# EasyEDA Pro project lune-v6-rev3.3.eprj, board PCB1_1
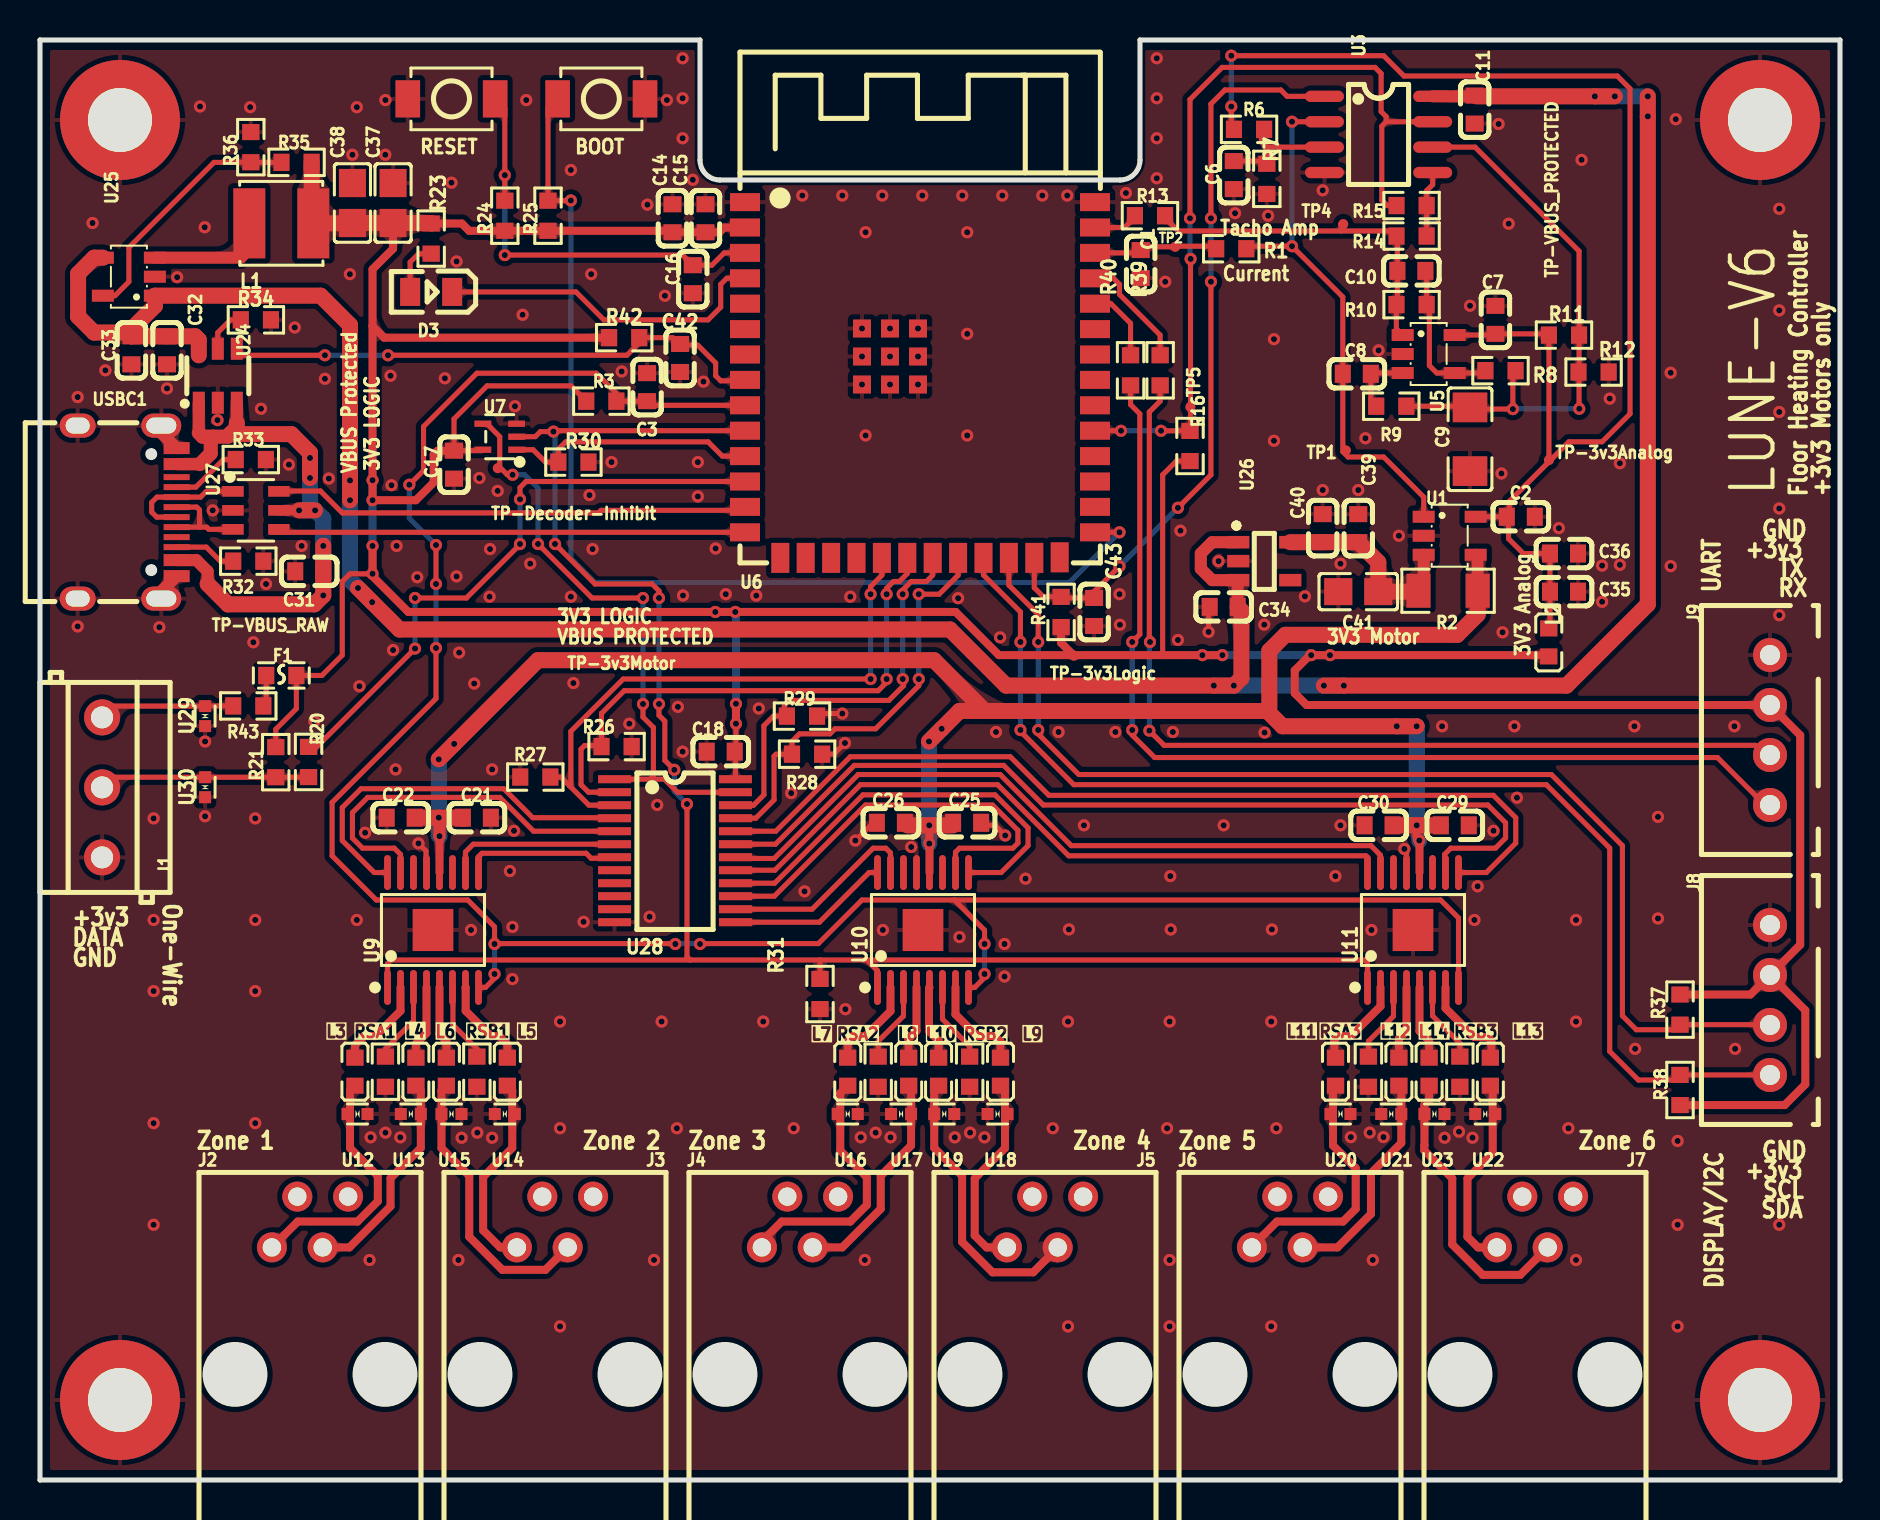
[diagram p5: board, top side]
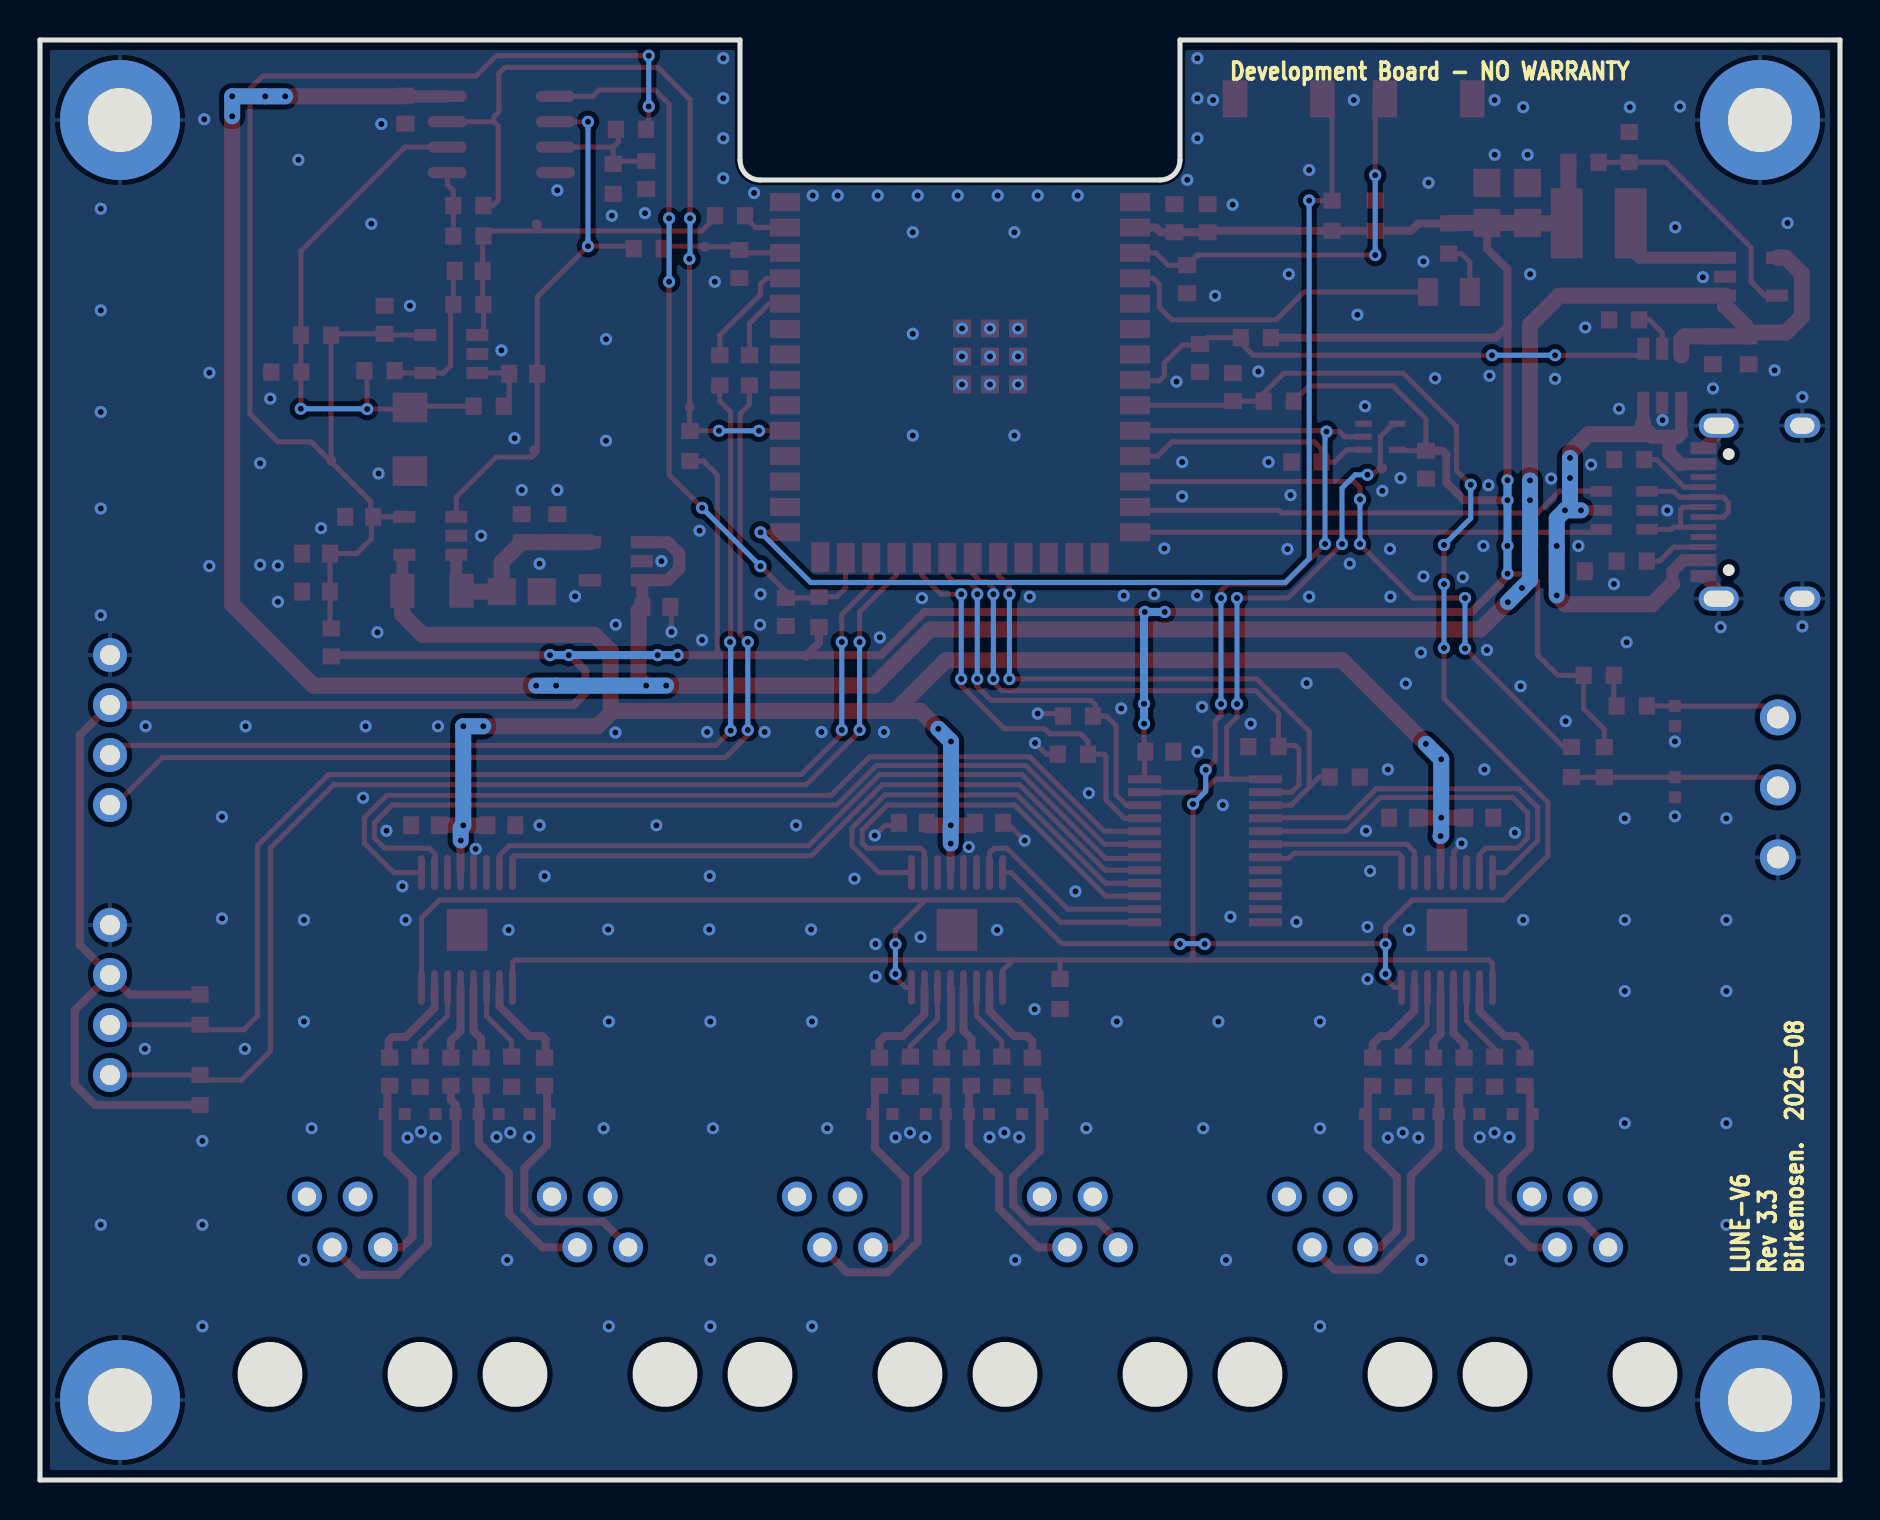
[diagram p6: board, bottom side, seen from below]

Outline 90 x 72 mm; copper layers: Top Layer, Bottom Layer. Coordinates in mm from the lower left corner of the outline.
Outline path: 0,72 33,72 33,66 arc(33.29,65.29) 34,65 54,65 arc(54.71,65.29) 55,66 55,72 90,72 90,0 0,0 0,72
Stack: Top Layer 0.035mm / Dielectric1 1.51mm FR4 er 4.5 / Bottom Layer 0.035mm

## Design rules (mm)
template: JLCPCB Capability(Two Layers Board)
spacing copperThickness1oz (default): track to track 0.102, other pairs 0.152 to 0.3
spacing copperThickness2oz: track to track 0.203, other pairs 0.152 to 0.3
track width copperThickness1oz (default): min 0.127, default 0.254, max 2.54
track width copperThickness2oz: min 0.203, default 0.254, max 2.54
differential pair differentialPair (default): width min 0.127, default 0.254, max 2.54; gap min 0.152, default 0.152
via viaSize (default): diameter min 0.5, default 0.61, max 10; hole min 0.3, default 0.305, max 6.3

## Placement (name value [footprint] x y rotation side)
BOOT  TS-1088-AR02016  [SW-SMD_L3.9-W3.0-P4.45]  28.07 69.06 0 top
C1  100nF  [C0603]  55.03 60.8 90 top
C2  100nF  [C0603]  74.04 48.16 0 top
C3  100nF  [C0603]  30.35 54.64 90 top
C6  100nF  [C0603]  59.69 65.25 90 top
C7  100nF  [C0603]  72.77 58.01 270 top
C8  1uF  [C0603]  65.84 55.31 180 top
C9  22uF  [C1206]  71.5 52.04 90 top
C10  4.7nF  [C0603]  68.57 60.46 180 top
C11  100nF  [C0603]  71.74 68.52 270 top
C14  10uF  [C0603]  31.62 63.09 270 top
C15  100nF  [C0603]  33.27 63.09 270 top
C16  1uF  [C0603]  32.64 60.04 90 top
C17  100nF  [C0603]  20.7 50.77 270 top
C18  100nF  [C0603]  34.04 36.42 0 top
C21  100nF  [C0603]  21.84 33.11 180 top
C22  10uF  [C0603]  18.03 33.11 0 top
C25  100nF  [C0603]  46.35 32.86 180 top
C26  10uF  [C0603]  42.54 32.86 0 top
C29  100nF  [C0603]  70.74 32.73 180 top
C30  10uF  [C0603]  66.93 32.73 0 top
C31  1uF  [C0603]  13.46 45.43 0 top
C32  10uF  [C0603]  6.35 56.48 90 top
C33  100nF  [C0603]  4.57 56.48 90 top
C34  10uF  [C0603]  59.18 43.66 0 top
C35  10uF  [C0603]  76.2 44.42 0 top
C36  100nF  [C0603]  76.2 46.32 180 top
C37  22uF  [C0805]  17.65 63.85 270 top
C38  22uF  [C0805]  15.62 63.85 270 top
C39  10uF  [C0603]  65.91 47.59 270 top
C40  100nF  [C0603]  64.13 47.59 270 top
C41  22uF  [C0805]  65.91 44.42 0 top
C42  1nF  [C0603]  32 56.1 90 top
C43  1nF  [C0603]  52.71 43.4 270 top
D3  KT-0805G  [LED0805-R-RD]  19.56 59.4 180 top
F1  BSMD0603-010-36V  [F0603]  12.06 40.23 180 top
J1  DB301V-3.5-3P-GN-S  [CONN-TH_DB301V-3.5-3P-GN]  3.1 34.63 270 top
J2  5301-4P4C  [RJ11-TH_RJ11-4P4C]  13.5 12.9 0 top
J3  5301-4P4C  [RJ11-TH_RJ11-4P4C]  25.75 12.9 0 top
J4  5301-4P4C  [RJ11-TH_RJ11-4P4C]  38 12.9 0 top
J5  5301-4P4C  [RJ11-TH_RJ11-4P4C]  50.25 12.9 0 top
J6  5301-4P4C  [RJ11-TH_RJ11-4P4C]  62.5 12.9 0 top
J7  5301-4P4C  [RJ11-TH_RJ11-4P4C]  74.75 12.9 0 top
J8  B4B-XH-A(LF)(SN)  [CONN-TH_B4B-XH-A-LF-SN]  86.5 24 90 top
J9  B4B-XH-A(LF)(SN)  [CONN-TH_B4B-XH-A-LF-SN]  86.5 37.5 90 top
L1  2.2uH  [IND-SMD_L4.0-W4.0]  12.06 62.83 180 top
L2  GZ1608D601TF  [L0603]  75.44 41.88 270 top
L3  GZ1608D601TF  [L0603]  15.75 20.42 270 top
L4  GZ1608D601TF  [L0603]  18.8 20.42 270 top
L5  GZ1608D601TF  [L0603]  23.37 20.42 270 top
L6  GZ1608D601TF  [L0603]  20.32 20.42 270 top
L7  GZ1608D601TF  [L0603]  40.39 20.42 270 top
L8  GZ1608D601TF  [L0603]  43.43 20.42 270 top
L9  GZ1608D601TF  [L0603]  48.03 20.42 270 top
L10  GZ1608D601TF  [L0603]  44.93 20.42 270 top
L11  GZ1608D601TF  [L0603]  64.78 20.42 270 top
L12  GZ1608D601TF  [L0603]  67.94 20.42 270 top
L13  GZ1608D601TF  [L0603]  72.52 20.42 270 top
L14  GZ1608D601TF  [L0603]  69.46 20.42 270 top
NOREF  -  [Pad_e149]  4 68 0 top
NOREF#2  -  [Pad_e151]  86 68 0 top
NOREF#3  -  [Pad_e152]  4 4 0 top
NOREF#4  -  [Pad_e153]  86 4 0 top
R1  1kΩ  [R0603]  59.56 61.56 0 top
R2  500mΩ  [R1206]  70.4 44.46 0 top
R3  10kΩ  [R0603]  28.07 53.94 180 top
R6  12kΩ  [R0603]  60.45 67.53 180 top
R7  10kΩ  [R0603]  61.34 65.06 90 top
R8  1kΩ  [R0603]  73.03 55.47 180 top
R9  100kΩ  [R0603]  67.56 53.69 0 top
R10  100kΩ  [R0603]  68.58 58.77 0 top
R11  10kΩ  [R0603]  76.2 57.25 180 top
R12  4.7kΩ  [R0603]  77.68 55.4 180 top
R13  1kΩ  [R0603]  55.5 63.21 180 top
R14  4.7kΩ  [R0603]  68.58 62.2 0 top
R15  100kΩ  [R0603]  68.58 63.72 180 top
R16  10kΩ  [R0603]  57.5 51.7 90 top
R20  33Ω  [R0603]  13.43 35.9 90 top
R21  4.7kΩ  [R0603]  11.79 35.89 90 top
R23  1kΩ  [R0603]  19.56 62.07 90 top
R24  10kΩ  [R0603]  23.24 63.21 270 top
R25  10kΩ  [R0603]  25.4 63.21 270 top
R26  100kΩ  [R0603]  28.83 36.67 180 top
R27  100kΩ  [R0603]  24.77 35.15 0 top
R28  100kΩ  [R0603]  38.35 36.29 180 top
R29  100kΩ  [R0603]  38.1 38.19 180 top
R30  100kΩ  [R0603]  26.67 50.89 180 top
R31  100kΩ  [R0603]  39 24.3 270 top
R32  5.1kΩ  [R0603]  10.41 45.94 0 top
R33  5.1kΩ  [R0603]  10.54 51.02 0 top
R34  22kΩ  [R0603]  10.8 58.01 0 top
R35  68kΩ  [R0603]  12.83 65.88 180 top
R36  15kΩ  [R0603]  10.54 66.64 90 top
R37  4.7kΩ  [R0603]  82 23.52 270 top
R38  4.7kΩ  [R0603]  82 19.5 270 top
R39  1kΩ  [R0603]  56.01 55.48 270 top
R40  1kΩ  [R0603]  54.53 55.48 270 top
R41  10kΩ  [R0603]  51.05 43.4 270 top
R42  10kΩ  [R0603]  29.21 57.12 0 top
R43  4.7Ω  [R0603]  10.41 38.7 180 top
RESET  TS-1088-AR02016  [SW-SMD_L3.9-W3.0-P4.45]  20.57 69.06 0 top
RSA1  1Ω  [R0603]  17.27 20.42 90 top
RSA2  1Ω  [R0603]  41.91 20.42 90 top
RSA3  1Ω  [R0603]  66.42 20.42 90 top
RSB1  1Ω  [R0603]  21.84 20.42 90 top
RSB2  1Ω  [R0603]  46.48 20.42 90 top
RSB3  1Ω  [R0603]  70.99 20.42 90 top
TP1  CURRENT_RAW  [Test-Point-0.5mm]  65.29 51.48 90 top
TP2  ADC_CURRENT  [Test-Point-0.5mm]  56.76 61.66 0 top
TP4  TACHO_AMP  [Test-Point-0.5mm]  65.16 62.8 270 top
TP5  -  [Test-Point-0.5mm]  57.52 53.65 180 top
TP-3v3Analog  PWR_FLAG  [Test-Point-0.5mm]  75.45 51 90 top
TP-3v3Logic  PWR_FLAG  [Test-Point-0.5mm]  51.69 41.22 180 top
TP-3v3Motor  PWR_FLAG  [Test-Point-0.5mm]  25.8 40.93 180 top
TP-Decoder-Inhibit  -  [Test-Point-0.5mm]  22.89 50.59 0 top
TP-VBUS_PROTECTED  PWR_FLAG  [Test-Point-0.5mm]  76.29 69.17 270 top
TP-VBUS_RAW  PWR_FLAG  [Test-Point-0.5mm]  9.44 43.8 270 top
U1  INA180A1IDBVR  [SOT-23-5_L3.0-W1.7-P0.95-LS2.8-BR]  70.49 47.21 180 top
U3  LMV393IDR  [SOIC-8_L5.0-W4.0-P1.27-LS6.0-BL]  66.93 67.28 270 top
U5  TLV9001IDBVR  [SOT-23-5_L3.0-W1.7-P0.95-LS2.8-BR]  69.43 56.3 180 top
U6  2.4GHz  [WIRELM-SMD_ESP32-S3-WROOM-1]  44 55 0 top
U7  SN74LVC1G00DCKR  [SOT-353_L2.1-W1.3-P0.65-LS2.3-BR]  22.99 52.17 0 top
U9  DRV8411PWPR  [HTSSOP-16_L5.0-W4.4-P0.65-LS6.4-TL-EP-1]  19.65 27.5 90 top
U10  DRV8411PWPR  [HTSSOP-16_L5.0-W4.4-P0.65-LS6.4-TL-EP-1]  44.15 27.5 90 top
U11  DRV8411PWPR  [HTSSOP-16_L5.0-W4.4-P0.65-LS6.4-TL-EP-1]  68.65 27.5 90 top
U12  TPD1E10B06DPYR  [X1SON-2_L1.0-W0.6-P0.65-BI-1]  15.88 18.3 0 top
U13  TPD1E10B06DPYR  [X1SON-2_L1.0-W0.6-P0.65-BI-1]  18.54 18.3 180 top
U14  TPD1E10B06DPYR  [X1SON-2_L1.0-W0.6-P0.65-BI-1]  23.24 18.3 180 top
U15  TPD1E10B06DPYR  [X1SON-2_L1.0-W0.6-P0.65-BI-1]  20.57 18.3 0 top
U16  TPD1E10B06DPYR  [X1SON-2_L1.0-W0.6-P0.65-BI-1]  40.39 18.3 0 top
U17  TPD1E10B06DPYR  [X1SON-2_L1.0-W0.6-P0.65-BI-1]  43.05 18.3 180 top
U18  TPD1E10B06DPYR  [X1SON-2_L1.0-W0.6-P0.65-BI-1]  47.88 18.3 180 top
U19  TPD1E10B06DPYR  [X1SON-2_L1.0-W0.6-P0.65-BI-1]  45.21 18.3 0 top
U20  TPD1E10B06DPYR  [X1SON-2_L1.0-W0.6-P0.65-BI-1]  65.02 18.3 0 top
U21  TPD1E10B06DPYR  [X1SON-2_L1.0-W0.6-P0.65-BI-1]  67.56 18.3 180 top
U22  TPD1E10B06DPYR  [X1SON-2_L1.0-W0.6-P0.65-BI-1]  72.26 18.3 180 top
U23  TPD1E10B06DPYR  [X1SON-2_L1.0-W0.6-P0.65-BI-1]  69.72 18.3 0 top
U24  TPS2553DBVR  [SOT-23-6_L2.9-W1.6-P0.95-LS2.8-BR]  8.89 55.21 270 top
U25  SY8089AAAC  [SOT-23-5_L3.0-W1.7-P0.95-LS2.8-BR]  4.44 60.17 0 top
U26  AP2112K-3.3TRG1  [SOT-25-5_L2.9-W1.6-P0.95-LS2.8-BL]  61.21 45.94 270 top
U27  USBLC6-2SC6  [SOT-23-6_L2.9-W1.6-P0.95-LS2.8-BL]  10.8 48.48 270 top
U28  74HC4514PW,118  [TSSOP-24_L7.8-W4.4-P0.65-LS6.4-BL]  31.75 31.46 270 top
U29  TPD1E10B06DPYR  [X1SON-2_L1.0-W0.6-P0.65-BI-1]  8.25 38.19 90 top
U30  TPD1E10B06DPYR  [X1SON-2_L1.0-W0.6-P0.65-BI-1]  8.25 34.64 90 top
USBC1  TYPE-C-31-M-12  [USB-C_SMD-TYPE-C-31-M-12_1]  4.36 48.39 270 top

## Footprints (pads in the part's own frame, mm; a bottom-side part is the same pattern mirrored in y, then rotated)
C0603
  rect 0.8x0.9 smd: 1(-0.7,0) 2(0.7,0)
C0805
  rect 1.41x1.35 smd: 1(-1,0) 2(1,0)
C1206
  rect 1.485x1.728 smd: 1(-1.593,0) 2(1.593,0)
CONN-TH_B4B-XH-A-LF-SN
  round 1.7 hole 1: 1(3.75,0) 2(1.25,0) 3(-1.25,0) 4(-3.75,0)
CONN-TH_DB301V-3.5-3P-GN
  round 1.8 hole 1.1: 1(-3.5,0) 2(0,0) 3(3.5,0)
F0603
  rect 0.806x0.864 smd: 1(-0.753,0) 2(0.753,0)
HTSSOP-16_L5.0-W4.4-P0.65-LS6.4-TL-EP-1
  oval 1.747x0.343 smd: 1(-2.873,2.275) 2(-2.873,1.625) 3(-2.873,0.975) 4(-2.873,0.325) 5(-2.873,-0.325) 6(-2.873,-0.975) 7(-2.873,-1.625) 8(-2.873,-2.275) 9(2.873,-2.275) 10(2.873,-1.625) 11(2.873,-0.975) 12(2.873,-0.325) 13(2.873,0.325) 14(2.873,0.975) 15(2.873,1.625) 16(2.873,2.275)
  rect 2.105x2.03 smd: 17(0,0)
IND-SMD_L4.0-W4.0
  rect 1.6x3.5 smd: 1(-1.6,0) 2(1.6,0)
L0603
  rect 0.8x0.864 smd: 1(-0.7,0) 2(0.7,0)
LED0805-R-RD
  rect 1x1.399 smd: 1(1.05,0) 2(-1.05,0)
Pad_e149
  round 6 hole 3.2: 1(0,0)
Pad_e151
  round 6 hole 3.2: 1(0,0)
Pad_e152
  round 6 hole 3.2: 1(0,0)
Pad_e153
  round 6 hole 3.2: 1(0,0)
R0603
  rect 0.806x0.864 smd: 1(-0.753,0) 2(0.753,0)
R1206
  rect 1.208x1.701 smd: 1(-1.479,0) 2(1.479,0)
RJ11-TH_RJ11-4P4C
  round 1.498 hole 0.914: 1(-1.905,-1.27) 2(-0.635,1.27) 3(0.635,-1.27) 4(1.905,1.27)
SOIC-8_L5.0-W4.0-P1.27-LS6.0-BL
  oval 0.569x1.95 smd: 1(-1.905,-2.705) 2(-0.635,-2.705) 3(0.635,-2.705) 4(1.905,-2.705) 5(1.905,2.705) 6(0.635,2.705) 7(-0.635,2.705) 8(-1.905,2.705)
SOT-23-5_L3.0-W1.7-P0.95-LS2.8-BR
  rect 1.1x0.6 smd: 1(1.3,-0.95) 2(1.3,0) 3(1.3,0.95) 4(-1.3,0.95) 5(-1.3,-0.95)
SOT-23-6_L2.9-W1.6-P0.95-LS2.8-BL
  rect 0.532x1.072 smd: 1(-0.95,-1.149) 2(0,-1.149) 3(0.95,-1.149) 4(0.95,1.149) 5(0,1.149) 6(-0.95,1.149)
SOT-23-6_L2.9-W1.6-P0.95-LS2.8-BR
  rect 1.1x0.6 smd: 1(1.35,-0.95) 2(1.35,0) 3(1.35,0.95) 4(-1.35,0.95) 5(-1.35,0) 6(-1.35,-0.95)
SOT-25-5_L2.9-W1.6-P0.95-LS2.8-BL
  rect 0.623x1.105 smd: 1(-0.95,-1.3) 2(-0.001,-1.3) 3(0.95,-1.3) 4(0.95,1.3) 5(-0.95,1.3)
SOT-353_L2.1-W1.3-P0.65-LS2.3-BR
  rect 0.839x0.315 smd: 1(0.845,-0.65) 2(0.845,0) 3(0.845,0.65) 4(-0.845,0.65) 5(-0.845,-0.65)
SW-SMD_L3.9-W3.0-P4.45
  rect 1.23x1.86 smd: 1(-2.185,0) 2(2.185,0)
Test-Point-0.5mm
  round 0.5 smd: 1(0,0)
TSSOP-24_L7.8-W4.4-P0.65-LS6.4-BL
  rect 0.4x1.65 smd: 1(-3.575,-3.022) 2(-2.925,-3.022) 3(-2.275,-3.022) 4(-1.625,-3.022) 5(-0.975,-3.022) 6(-0.325,-3.022) 7(0.325,-3.022) 8(0.975,-3.022) 9(1.625,-3.022) 10(2.275,-3.022) 11(2.925,-3.022) 12(3.575,-3.022) 13(3.575,3.022) 14(2.925,3.022) 15(2.275,3.022) 16(1.625,3.022) 17(0.975,3.022) 18(0.325,3.022) 19(-0.325,3.022) 20(-0.975,3.022) 21(-1.625,3.022) 22(-2.275,3.022) 23(-2.925,3.022) 24(-3.575,3.022)
USB-C_SMD-TYPE-C-31-M-12_1
  oval 1.2x2 hole 0.8x1.5: 1(4.325,1.706) 4(-4.325,1.706)
  oval 1.2x1.8 hole 0.8x1.2: 2(4.325,-2.474) 3(-4.325,-2.474)
  custom 0.6x1.3 smd: A1B12(-3.2,2.474) A4B9(-2.4,2.474) B1A12(3.2,2.474) B4A9(2.401,2.474)
  rect 0.3x1.3 smd: A5(-1.25,2.474) A6(-0.25,2.474) A7(0.25,2.474) A8(1.25,2.474) B5(1.75,2.474) B6(0.75,2.474) B7(-0.75,2.474) B8(-1.75,2.474)
WIRELM-SMD_ESP32-S3-WROOM-1
  rect 1.5x0.9 smd: 1(-8.75,8.895) 2(-8.75,7.625) 3(-8.75,6.355) 4(-8.75,5.085) 5(-8.75,3.815) 6(-8.75,2.545) 7(-8.75,1.275) 8(-8.75,0.005) 9(-8.75,-1.265) 10(-8.75,-2.535) 11(-8.75,-3.805) 12(-8.75,-5.075) 13(-8.75,-6.345) 14(-8.75,-7.615) 27(8.75,-7.615) 28(8.75,-6.345) 29(8.75,-5.075) 30(8.75,-3.805) 31(8.75,-2.535) 32(8.75,-1.265) 33(8.75,0.005) 34(8.75,1.275) 35(8.75,2.545) 36(8.75,3.815) 37(8.75,5.085) 38(8.75,6.355) 39(8.75,7.625) 40(8.75,8.895)
  rect 0.9x1.5 smd: 15(-6.985,-8.895) 16(-5.715,-8.895) 17(-4.445,-8.895) 18(-3.175,-8.895) 19(-1.905,-8.895) 20(-0.635,-8.895) 21(0.635,-8.895) 22(1.905,-8.895) 23(3.175,-8.895) 24(4.445,-8.895) 25(5.715,-8.895) 26(6.985,-8.865)
  rect 0.9x0.9 smd: 41(-2.9,2.575) 41(-2.9,1.175) 41(-2.9,-0.225) 41(-1.5,2.575) 41(-1.5,1.175) 41(-1.5,-0.225) 41(-0.1,2.575) 41(-0.1,1.175) 41(-0.1,-0.225)
X1SON-2_L1.0-W0.6-P0.65-BI-1
  rect 0.6x0.6 smd: 1(-0.5,0) 2(0.5,0)

## Nets
As in the schematic, except:
GND: BOOT.2 C1.1 C2.2 C3.2 C6.1 C7.1 C9.1 C11.2 C14.1 C15.1 C16.1 C17.2 C18.1 C21.1 C22.1 C25.1 C26.1 C29.1 C30.1 C31.1 C32.1 C33.1 C34.1 C35.2 C36.1 C37.1 C38.1 C39.1 C40.1 C41.1 C42.1 C43.2 J1.3 J8.1 J9.1 NOREF.1 NOREF#2.1 NOREF#3.1 NOREF#4.1 R7.1 R12.1 R26.1 R27.1 R28.1 R29.1 R30.1 R31.2 R32.2 R33.2 R34.2 R36.2 RESET.1 RSA1.1 RSA2.1 RSA3.1 RSB1.1 RSB2.1 RSB3.1 U1.2 U3.4 U5.2 U6.1 U6.40 U6.41 U7.3 U9.13 U9.17 U10.13 U10.17 U11.13 U11.17 U12.2 U13.2 U14.2 U15.2 U16.2 U17.2 U18.2 U19.2 U20.2 U21.2 U22.2 U23.2 U24.2 U25.2 U26.2 U27.2 U28.12 U29.1 U30.1 USBC1.1 USBC1.2 USBC1.3 USBC1.4 USBC1.A1B12 USBC1.B1A12

Pads without a net: J2 2 4; J3 2 4; J4 2 4; J5 2 4; J6 2 4; J7 2 4; U6 5 6 7 15 16 17 18 26 28 29 30 32 33 34 35; U9 11 14; U10 11 14; U11 11 14; U26 4; U28 8 9 10 11; USBC1 A8 B8

## Via types
v1: diameter 0.61, hole 0.305, Top Layer to Bottom Layer, 356 vias

## Routing (per net, layer and track width the routed paths; a pad name or vN(x,y) marks a point on that pad's centre or on a via; arc(x,y) is an arc through that point)
3V3_ANALOG: length 69.2
  Top Layer w0.254: v1(59.56,68.67) 59.56,67.54 59.57,67.53 ; 75.45,50.91 R11.2 75.43,57.25 75.37,57.31 C7.2 72.71,57.25 70.73,57.25 ; 75.45,50.91 76.45,51.91 78.1,51.91 79.5,53.31 79.5,69.56 78.87,70.2 68.2,70.2 67.18,71.22 v1(59.56,71.22) ; 75.45,50.91 73.47,48.93 73.47,48.23 73.4,48.16 ; L2.1 75.5,42.64 C35.1 C36.2 74.17,46.32 73.43,47.06 73.43,48.14 73.4,48.16 ; 73.4,48.16 71.78,48.16
  Bottom Layer w0.254: v1(59.56,71.22) v1(59.56,68.67)
3V3_EXT: length 6.9
  Top Layer w0.254: U29.2 8.26,38.7 R43.2 ; U29.2 8.2,38.64 ; U29.2 3.67,38.69 J1.1
3V3_EXT_FUSED: length 1.6
  Top Layer w0.254: F1.2 11.31,38.85 R43.1
3V3_LOGIC: length 230.1
  Top Layer w0.254: U28.24 34.77,36.38 C18.2 34.8,36.48 v1(34.8,37.81) ; 11.79,36.64 11.79,37.54 12.82,38.57 F1.1 14.1,40.23 15.11,41.24 15.11,44.93 15.49,45.31 16.62,45.31 v1(16.63,45.31) ; U7.5 22.1,51.47 C17.1 20.7,53.05 22.35,54.7 26.55,54.7 R3.2 ; 56.13,41.24 56.13,50.26 56.82,50.95 R16.1
  Top Layer w0.4: J8.2 88.26,23.48 88.26,19.78 87.23,18.75 R38.2 ; J8.2 88.01,26.76 88.01,37.24 J9.2 63.33,38.75 62.74,39.34 62.74,40.48 63.5,41.24 ; J8.2 85.52,24.27 R37.1 ; C37.2 17.65,61.56 16.63,60.54 16.63,57.7 ; 51.67,41.24 47.94,41.24 45.78,43.4 v1(34.76,43.4) v1(33.76,43.4) 18.42,43.4 16.63,45.19 v1(16.63,45.31) v1(16.63,46.7) ; 51.67,41.24 v1(58.12,41.24) v1(59.12,41.24) ; 51.67,41.24 51.05,41.86 R41.2 ; 16.63,57.7 v1(16.63,49.99) v1(16.63,48.99) 18.8,48.99 19.69,49.88 19.69,51.28 19.86,51.46 20.69,51.46 C17.1 ; 16.63,57.7 17.21,57.12 R42.1 ; R23.2 21.09,62.82 21.45,62.46 R24.2 R25.2 31.55,62.46 C14.2 C15.2 33.97,62.39 34.21,62.62 U6.2 ; 75.44,41.31 75.38,41.24 v1(64.5,41.24) v1(63.56,41.24) ; v1(34.8,37.81) v1(34.8,38.81)
  Top Layer w0.8: R23.2 19.53,62.85 C37.2 C38.2 15.61,62.83 L1.1 13.58,62.92 R35.1
  Bottom Layer w0.4: v1(58.12,41.24) v1(59.12,41.24) v1(63.56,41.24) v1(64.5,41.24) ; v1(16.63,49.99) v1(16.63,48.99) v1(16.63,46.7) v1(16.63,45.31) ; v1(33.76,43.4) v1(34.76,43.4) 34.8,43.37 v1(34.8,38.81) v1(34.8,37.81)
3V3_MOTOR: length 104.8
  Top Layer w0.4: U11.12 68.97,31.96 v1(68.96,31.98) 68.84,32.1 v1(68.84,32.73) ; v1(19.97,32.19) U9.12 ; v1(44.46,32.73) v1(44.46,31.82) 44.47,31.81 U10.12
  Top Layer w0.6: R2.2 71.88,46.17 71.78,46.26 ; v1(19.94,33.11) 19.97,33.08 v1(19.97,32.19)
  Top Layer w0.8: 67.88,32.73 v1(68.84,32.73) 70.04,32.73 ; 47.24,38.45 61.37,38.45 62.13,37.69 v1(67.84,37.69) v1(68.83,37.69) ; 47.24,38.45 45.97,38.45 v1(45.09,37.56) v1(44.45,36.92) ; 47.24,38.45 44.7,40.99 24.89,40.99 v1(20.71,36.81) v1(19.94,36.04) ; 45.66,32.73 v1(44.46,32.73) 43.37,32.73 ; 18.86,33.11 v1(19.94,33.11) 21.08,33.11 21.14,33.05 ; 61.47,38.63 61.47,41.46 62.27,42.26 70.87,42.26 71.88,43.28 R2.2
  Bottom Layer w0.8: v1(19.97,32.19) 19.94,32.23 v1(19.94,33.11) v1(19.94,36.04) v1(20.71,36.81) ; v1(68.96,31.98) 68.96,32.61 v1(68.84,32.73) 68.84,37.68 v1(68.83,37.69) v1(67.84,37.69) ; v1(44.46,31.82) v1(44.46,32.73) 44.45,32.75 v1(44.45,36.92) v1(45.09,37.56)
3V3_MOTOR_REG: length 10.2
  Top Layer w0.6: R2.1 69.19,44.72 U1.3
  Top Layer w0.8: 68.88,44.42 C41.2 66.91,45.89 C39.2 C40.2 ; U26.5 64.13,46.89
GND: length 12.5
  Top Layer w0.254: v1(18.92,31.83) 19.3,31.45 19.3,30.86 19.33,30.84 U9.13 ; v1(58.43,42.4) 58.43,43.6 C34.1 ; v1(40.12,38.32) 38.98,38.32 R29.1 ; R28.1 39.69,36.29 v1(40.25,36.85) ; 41.84,32.73 41.53,32.73 v1(40.77,31.97) ; v1(68.22,31.55) 68.32,31.45 68.32,30.37 ; 47.06,32.73 47.75,32.73 v1(48.26,32.23)
  Top Layer w0.6: USBC1.A1B12 6.06,52.36 USBC1.4 ; USBC1.1 6.06,44.43 USBC1.B1A12
  vias: v1(1.88,54.15) v1(1.88,42.68) v1(2.63,62.85) v1(3.27,55.48) v1(5.68,33.08) v1(5.68,28) v1(5.68,24.45) v1(5.68,17.84) v1(5.68,12.76) v1(5.97,42.64) v1(6.35,54.58) v1(6.86,60.14) v1(8,68.67) v1(8.24,62.64) v1(8.25,36.92) v1(8.25,33.19) v1(8.64,48.48) v1(8.87,52.99) v1(10.51,68.64) v1(10.67,41.89) v1(10.76,33.08) v1(10.76,28) v1(10.76,24.45) v1(10.76,17.84) v1(11.05,53.56) v1(11.3,44.8) v1(12.45,50.77) v1(12.74,57.63) v1(13.08,46.7) v1(13.72,37.94) v1(14.25,55.06) v1(14.44,50.07) v1(15.49,60.29) v1(15.62,66.26) v1(15.84,68.64) v1(15.84,28) v1(15.97,39.69) v1(16.26,32.36) v1(16.53,17.13) v1(16.48,11) v1(17.27,69) v1(17.27,66.26) v1(17.27,17.37) v1(17.53,55.21) v1(17.58,49.74) v1(17.65,41.5) v1(17.83,46.7) v1(17.78,35.53) v1(18.01,17.13) v1(18.86,45.14) v1(20.24,55.09) v1(20.57,64.86) v1(20.83,60.93) v1(20.83,45.18) v1(20.92,11) v1(20.95,41.37) v1(21.08,17.11) v1(21.55,27.5) v1(21.71,39.82) v1(21.87,17.37) v1(21.97,50.1) v1(22.5,46.55) v1(22.48,44.16) v1(22.61,35.53) v1(22.61,17.11) v1(22.88,49.46) v1(23.5,30.45) v1(23.62,27.65) v1(23.62,25.05) v1(23.75,53.69) v1(23.7,32.46) v1(24.13,58.26) v1(24.31,69) v1(24.51,45.81) v1(26,22.92) v1(26,17.59) v1(26,7.68) v1(26.54,65.5) v1(26.54,44.16) v1(26.67,39.85) v1(27.18,27.91) v1(27.47,49.24) v1(27.56,60.29) v1(27.63,46.55) v1(28.57,50.89) v1(29.08,55.43) v1(29.46,37.81) v1(30.37,63.77) v1(30.48,28.16) v1(30.7,11) v1(30.86,33.75) v1(31.08,22.92) v1(31.25,59.21) v1(31.35,69) v1(31.84,17.59) v1(31.9,38.66) v1(32.13,71.09) v1(32.13,69.09) v1(32.13,67.09) v1(32.15,44.23) v1(32.13,36.42) v1(32.64,65.01) v1(32.89,50.89) v1(32.89,49.18) v1(33.18,54.92) v1(33.78,46.58) v1(34.29,44.29) v1(35.81,44.22) v1(35.94,38.58) v1(36.16,22.92) v1(37.56,34.34) v1(37.69,17.59) v1(38.12,64.22) v1(38.23,29.43) v1(40.12,64.22) v1(40.27,23.54) v1(40.51,44.16) v1(41.04,17.13) v1(41.1,57.58) v1(41.1,56.17) v1(41.1,54.78) v1(41.24,11) v1(41.28,62.39) v1(41.28,52.23) v1(41.78,17.37) v1(42.12,64.22) v1(42.14,27.5) v1(42.5,57.58) v1(42.5,56.17) v1(42.5,54.78) v1(42.53,17.13) v1(43.56,31.65) v1(43.9,57.58) v1(43.9,56.17) v1(43.9,54.78) v1(44.12,64.22) v1(45.74,17.13) v1(45.91,44.09) v1(45.97,27.15) v1(46.12,64.22) v1(46.36,62.39) v1(46.36,57.31) v1(46.36,52.23) v1(46.5,17.37) v1(47.22,17.13) v1(47.8,37.4) v1(48.01,42.13) v1(48.12,64.22) v1(48.23,26.8) v1(48.23,25.17) v1(49.28,30.07) v1(50.12,64.22) v1(50.64,17.59) v1(50.93,37.4) v1(51.36,64.22) v1(51.45,27.53) v1(51.4,22.92) v1(51.4,7.68) v1(52.2,32.73) v1(53.77,37.4) v1(53.97,44.29) v1(54,42.76) v1(54.3,64.35) v1(55.84,71.09) v1(55.84,69.09) v1(55.84,67.09) v1(55.84,65.09) v1(56.26,59.91) v1(56.35,17.59) v1(56.51,30.19) v1(56.54,27.53) v1(56.48,22.92) v1(56.48,11) v1(56.48,7.68) v1(56.64,37.4) v1(56.9,42) v1(57.02,47.47) v1(58.93,45.94) v1(59.18,32.73) v1(59.75,63.34) v1(61.21,42.77) v1(61.23,37.37) v1(61.41,63.21) v1(61.59,27.53) v1(61.56,22.92) v1(61.56,7.68) v1(61.7,57.04) v1(61.7,51.96) v1(61.82,17.59) v1(63.25,44.18) v1(64.13,64.48) v1(64.13,49.5) v1(64.77,30.19) v1(65.02,45.81) v1(65.02,32.73) v1(65.54,17.14) v1(65.91,49.5) v1(66.27,52.09) v1(66.49,17.37) v1(66.57,27.5) v1(66.64,11) v1(66.93,56.48) v1(67.17,17.14) v1(67.94,47.21) v1(70.1,37.69) v1(70.23,17.11) v1(70.95,17.41) v1(71.5,58.71) v1(71.62,17.11) v1(71.72,28) v1(71.88,29.69) v1(72.68,32.46) v1(72.93,67.8) v1(73.07,50.33) v1(73.13,42.39) v1(73.43,62.81) v1(73.72,37.69) v1(73.85,34.11) v1(75.95,47.59) v1(76.42,17.59) v1(76.8,28) v1(76.8,22.92) v1(76.8,11) v1(77.08,66.01) v1(78.1,45.72) v1(78.1,43.91) v1(78.49,54.07) v1(78.99,50.84) v1(78.99,45.76) v1(79.72,37.69) v1(79.76,21.56) v1(80.9,33.16) v1(80.9,28.08) v1(81.53,55.36) v1(81.53,45.69) v1(81.79,68.04) v1(81.88,16.95) v1(81.88,12.76) v1(81.88,7.68) v1(84.72,37.69) v1(84.76,21.56) v1(86.96,63.56) v1(86.96,58.48) v1(86.96,53.4) v1(86.96,48.58) v1(86.96,43.24) v1(86.96,12.76)
VBUS_PROTECTED: length 158.1
  Top Layer w0.254: 71.83,69.18 71.86,69.21
  Top Layer w0.6: U26.1 58.61,46.89 58.04,46.32 58.04,45.56 58.61,44.99 U26.3 59.88,44.96 C34.2 ; U3.8 71.83,69.18
  Top Layer w0.8: v1(78.74,69.18) v1(77.74,69.18) 71.83,69.18 ; v1(15.9,44.6) v1(16.61,43.89) 17.97,42.53 45.5,42.53 48.31,39.72 v1(58.69,39.72) v1(59.69,39.72) 60.07,40.1 60.07,43.47 C34.2 ; C33.2 4.7,57.31 4.7,57.66 5.75,58.71 U25.1 14.03,59.22 15.5,57.75 v1(15.5,49.98) 15.5,48.98 ; C33.2 4.38,57.37 2.7,57.37 1.91,58.17 1.91,60.32 2.7,61.12 U25.4 ; C33.2 C32.2 7.76,57.18 7.94,57 7.94,56.23 ; v1(64.19,39.72) v1(65.19,39.72) 76.33,39.72 80.39,43.78 v1(80.39,69.18)
  Bottom Layer w0.8: v1(80.39,68.18) v1(80.39,69.18) v1(78.74,69.18) v1(77.74,69.18) ; v1(16.61,43.89) v1(15.9,44.6) 15.5,45 15.5,46.7 15.49,46.71 15.49,48.98 15.5,48.98 ; v1(15.5,49.98) v1(15.5,48.99) ; v1(65.19,39.72) v1(64.19,39.72) v1(59.69,39.72) v1(58.69,39.72)
VBUS_RAW: length 34.5
  Top Layer w0.5: v1(12.95,48.48) U27.5
  Top Layer w0.6: 9.84,52.86 9.84,53.94 ; USBC1.A4B9 8,50.79 ; U24.1 7.94,52.35 ; USBC1.B4A9 7.82,45.99 8.38,45.43 8.38,44.8
  Top Layer w0.7: 8.66,52.17 8.54,52.04 8.54,51.33 8,50.79 ; 8.66,52.17 9.4,52.17 9.53,52.29 ; 8.66,52.17 8.13,52.17 7.94,52.35
  Top Layer w0.8: 8.38,44.8 9.4,43.78 13.72,43.78 v1(14.16,44.23) C31.2 14.16,46.72 ; v1(12.95,48.48) v1(13.75,48.48) ; 9.84,52.86 9.84,52.61 9.53,52.29 12.57,52.29 13.5,51.36 v1(13.5,51.1) v1(13.5,50.1)
  Bottom Layer w0.8: v1(14.16,44.23) v1(14.16,46.7) 14.16,48.07 v1(13.75,48.48) ; v1(13.75,48.48) 13.5,48.74 v1(13.5,50.1) v1(13.5,51.1) ; v1(13.75,48.48) v1(12.95,48.48)
ADC_CURRENT: length 6.2
  Top Layer w0.254: U6.38 54.89,61.36 C1.2 55.19,61.66 TP2.1 56.79,61.69 58.81,61.69
ADC_TACHO: length 2.3
  Top Layer w0.254: U6.39 54.23,62.62 54.79,63.19
AISEN1: length 4
  Top Layer w0.254: RSA1.2 17.27,21.56 18.67,22.96 U9.3
AISEN3: length 4
  Top Layer w0.254: RSA2.2 41.91,21.94 43.18,23.2 U10.3
AISEN5: length 4
  Top Layer w0.254: RSA3.2 66.42,21.94 67.68,23.19 U11.3
BISEN2: length 4
  Top Layer w0.254: U9.6 20.65,24.6 20.65,22.75 21.84,21.56 RSB1.2
BISEN4: length 4
  Top Layer w0.254: RSB2.2 46.48,21.69 45.12,23.04 U10.6
BISEN6: length 4
  Top Layer w0.254: U11.6 69.62,23.21 70.99,21.84 RSB3.2
BOOT_N: length 54.5
  Top Layer w0.254: U6.27 v1(53.97,47.39) ; BOOT.1 25.4,68.57 R25.1 26.53,63.97 v1(26.54,63.98)
  Bottom Layer w0.254: v1(53.97,47.39) 51.47,44.88 27.74,44.88 26.54,46.07 v1(26.54,63.98)
COMM_TACHO_N: length 41.4
  Top Layer w0.254: U6.31 54.04,52.47 v1(54.05,52.46) ; R15.2 67.36,63.72 67.09,63.99 67.09,67.69 67.31,67.91 ; v1(57.53,61.06) 57.53,61.05 57.53,52.46 v1(56.05,52.46) ; 67.31,67.91 69.63,67.91 ; 67.31,67.91 67.31,68.17 67.06,68.42 67.06,70.33 66.75,70.63 59.11,70.63 57.5,69.02 v1(57.5,63.09)
  Bottom Layer w0.254: v1(57.53,61.06) 57.5,61.09 v1(57.5,63.09) ; v1(54.05,52.46) v1(56.05,52.46)
CURRENT_RAW: length 27.4
  Top Layer w0.254: U1.1 69.19,49.15 67.18,51.15 65.41,51.15 65.14,51.41 C8.2 65.14,59.15 v1(62.6,61.69) 60.32,61.69 ; v1(62.6,67.91) 64.22,67.91
  Bottom Layer w0.254: v1(62.6,61.69) v1(62.6,67.91)
DECODER_INHIBIT: length 29.8
  Top Layer w0.254: v1(30.15,44.1) 27.6,44.1 v1(24.9,46.8) ; 30.5,35.04 31.22,35.04 31.88,34.39 34.77,34.39 U28.23 ; 30.5,35.04 30.67,35.21 30.67,37.62 30.15,38.14 v1(30.15,38.8) ; 30.5,35.04 U28.1 ; U7.4 22.14,52.81 22.15,52.8 22.35,52.8 22.99,52.17 22.99,50.64 23.37,50.26 v1(23.63,50.26)
  Bottom Layer w0.254: v1(23.63,50.26) 24.24,50.26 24.9,49.6 v1(24.9,46.8) ; v1(30.15,44.1) v1(30.15,38.8)
DRIVER_N_SLEEP: length 96.6
  Top Layer w0.254: 23.83,52.17 24.77,52.17 25.02,52.42 v1(25.67,52.42) 25.72,52.47 U6.10 ; v1(25.75,46.8) 27.75,44.8 30.61,44.8 30.95,44.46 v1(30.95,44.1) ; U11.1 66.38,25.87 66.24,26 41.34,26 ; v1(31.72,35.51) 31.24,35.98 31.24,37.94 30.95,38.23 v1(30.95,38.8) ; R31.1 39,25.99 39.01,26 ; v1(32.35,33.8) 32.35,26.16 32.51,26 ; 32.51,26 17.55,26 17.38,25.82 U9.1 ; 32.51,26 39.01,26 ; 41.34,26 41.88,25.47 U10.1 ; 41.34,26 39.01,26
  Bottom Layer w0.254: v1(32.35,33.8) 31.72,34.44 v1(31.72,35.51) ; v1(25.75,46.8) 25.75,52.34 v1(25.67,52.42) ; v1(30.95,38.8) v1(30.95,44.1)
ESP_EN: length 21.8
  Top Layer w0.254: R24.1 v1(23.24,65.24) 23.24,68.57 RESET.2 ; v1(23.24,61.25) 32.13,61.25 C16.2 33.59,60.74 34.21,61.36 U6.3
  Bottom Layer w0.254: v1(23.24,61.25) 23.24,65.25
FAULT_N_RAW: length 114.2
  Top Layer w0.254: U6.9 30.56,53.73 C3.1 R3.1 28.82,54.33 27.81,55.34 21.84,55.34 19.18,52.67 19.18,50.47 v1(18.46,49.76) ; v1(19.8,41.6) 19.8,39.07 14.61,33.88 14.61,31.21 16.81,29 21.39,29 22.73,27.66 v1(22.73,26.8) 22.75,26.82 31.77,26.82 ; 45.72,29 41.1,29 38.92,26.82 33,26.82 ; 45.72,29 47.23,27.49 v1(47.23,26.8) ; 45.72,29 70.03,29 70.93,28.1 U11.8 ; v1(22.73,25.3) 22.73,25.08 22.27,24.63 21.93,24.63 ; v1(19.8,46.75) v1(19.8,44.8) ; U10.8 46.74,24.63 47.23,25.12 v1(47.23,25.3)
  Bottom Layer w0.254: v1(18.46,49.76) 18.46,48.09 v1(19.8,46.75) ; v1(47.23,25.3) v1(47.23,26.8) ; 31.77,26.82 33,26.82 ; v1(19.8,44.8) v1(19.8,41.6) ; v1(22.73,26.8) v1(22.73,25.3)
  vias: v1(31.77,26.8) v1(33,26.8)
FAULT_USB_RAW: length 27.2
  Top Layer w0.254: v1(17.4,56.24) 29.35,56.24 29.96,56.86 R42.2 31.63,57.12 32,56.74 32.89,56.74 33.78,55.85 33.78,55.21 34.04,54.96 35.2,54.96 U6.8 ; 9.84,56.23 14.24,56.23 v1(14.25,56.24)
  Bottom Layer w0.254: v1(17.4,56.24) v1(14.25,56.24)
FLIM_REF: length 6.4
  Top Layer w0.254: 61.08,67.53 61.08,66.91 61.34,66.64 ; U3.3 61.34,66.64 ; 61.34,66.64 R7.2 61.21,65.95 C6.2
FWD1: length 19.2
  Top Layer w0.254: U28.4 28.6,33.09 28.57,33.11 24.64,33.11 23.19,34.56 16.05,34.56 15.11,33.62 15.11,31.97 16.71,30.37 U9.16
FWD2: length 7.8
  Top Layer w0.254: 21.92,30.37 21.92,30.38 21.92,31.16 22.1,31.34 27.31,31.34 27.56,31.08 28.67,31.08 U28.7
FWD3: length 8.1
  Top Layer w0.254: U10.16 41.45,30.37 38.97,27.89 U28.13
FWD4: length 21.6
  Top Layer w0.254: U28.16 36.73,29.84 41.15,34.26 47.75,34.26 49.4,32.6 49.4,31.72 48.06,30.37 U10.9
FWD5: length 35.6
  Top Layer w0.254: U11.16 66.38,31.13 66.29,31.21 51.44,31.21 47.88,34.77 41.02,34.77 36.74,30.49 U28.17
FWD6: length 46.6
  Top Layer w0.254: U28.20 36.79,32.44 40.51,36.16 48.51,36.16 50.44,34.23 72.67,34.23 73.79,33.11 73.79,31.84 72.31,30.37 U11.9
I2C_SCL: length 57.2
  Top Layer w0.254: v1(49.91,41.9) 49.91,43.28 48.44,44.74 U6.24 ; J8.3 86.48,22.77 R37.2 81.75,22.51 79.82,22.51 79.12,23.21 79.12,31.72 75.56,35.27 51.94,35.27 49.91,37.3 v1(49.91,37.5)
  Bottom Layer w0.254: v1(49.91,41.9) v1(49.91,37.5)
I2C_SDA: length 60.2
  Top Layer w0.254: U6.23 47.18,45.25 49.02,43.4 v1(49.02,41.9) ; J8.4 86.5,20.25 R38.1 81.75,20 79.92,20 78.49,21.43 78.49,31.6 75.32,34.77 51.69,34.77 49.02,37.43 v1(49.02,37.5)
  Bottom Layer w0.254: v1(49.02,41.9) v1(49.02,37.5)
LOGIC_FB: length 12.7
  Top Layer w0.254: U25.5 3.75,59.22 4.44,59.91 4.44,61.63 8.7,65.88 9.14,65.88 9.14,65.89 10.67,65.89 10.68,65.88 R35.2
LOGIC_SW: length 6.2
  Top Layer w0.6: L1.2 10.47,61.55 10.03,61.12 U25.3
MOTOR_1A: length 4.8
  Top Layer w0.4: L3.1 15.75,21.74 16.2,22.19 16.76,22.19 18.03,23.45 U9.2
MOTOR_1A_J: length 12.7
  Top Layer w0.4: J2.1 12.89,12.92 15.88,12.92 16.89,13.94 16.89,15.21 15.5,16.6 15.5,19.47 L3.2
MOTOR_1B: length 3.7
  Top Layer w0.4: U9.4 19.33,22.34 18.8,21.81 L4.1
MOTOR_1B_J: length 11
  Top Layer w0.4: L4.2 19.04,19.47 19.04,16.61 17.53,15.09 17.53,13.68 15.47,11.63 J2.3
MOTOR_2A: length 4.6
  Top Layer w0.4: L5.1 23.37,21.79 22.97,22.19 22.55,22.19 21.28,23.46 21.28,24.62 U9.7
MOTOR_2A_J: length 10
  Top Layer w0.4: J3.1 23.01,11.63 22.16,12.48 22.16,15.15 23.61,16.61 23.61,19.47 L5.2
MOTOR_2B: length 3.7
  Top Layer w0.4: U9.5 19.97,22.28 20.32,21.94 L6.1
MOTOR_2B_J: length 14.3
  Top Layer w0.4: L6.2 20.07,19.47 20.07,16.6 21.46,15.21 21.46,12.16 23.11,10.51 25.27,10.51 26.39,11.62 J3.3
MOTOR_3A: length 4.8
  Top Layer w0.4: L7.1 40.39,21.94 40.64,22.19 41.28,22.19 42.53,23.44 U10.2
MOTOR_3A_J: length 13
  Top Layer w0.4: J4.1 36.09,11.93 37.08,12.92 40.51,12.92 41.34,13.75 41.34,15.14 40.01,16.47 40.01,19.34 L7.2
MOTOR_3B: length 3.7
  Top Layer w0.4: 43.82,24.63 43.82,22.46 43.43,22.06 43.43,21.12 L8.1
MOTOR_3B_J: length 11
  Top Layer w0.4: J4.3 40.11,11.63 42.04,13.56 42.04,15.21 43.55,16.72 43.55,19.6 L8.2
MOTOR_4A: length 5
  Top Layer w0.4: U10.7 45.78,23.28 46.86,22.19 47.75,22.19 48.03,21.92 48.03,21.1
MOTOR_4A_J: length 10.1
  Top Layer w0.4: L9.2 48.25,19.49 48.25,16.6 46.74,15.08 46.74,12.22 47.33,11.63 J5.1
MOTOR_4B: length 3.7
  Top Layer w0.4: 44.93,21.1 44.93,21.97 44.45,22.45 44.45,24.6 U10.5
MOTOR_4B_J: length 14.4
  Top Layer w0.4: L10.2 44.71,19.5 44.71,16.61 46.1,15.21 46.1,11.9 47.62,10.38 49.66,10.38 50.88,11.61 J5.3
MOTOR_5A: length 4.9
  Top Layer w0.4: U11.2 67.03,23.69 65.53,22.19 64.9,22.19 64.72,22.01 64.72,21.17 L11.1
MOTOR_5A_J: length 12.7
  Top Layer w0.4: L11.2 64.65,19.59 64.65,16.72 65.79,15.59 65.79,13.56 65.15,12.92 61.85,12.92 60.59,11.67 J6.1
MOTOR_5B: length 3.7
  Top Layer w0.4: 68.32,24.63 68.32,22.45 67.94,22.07 L12.1
MOTOR_5B_J: length 11.2
  Top Layer w0.4: L12.2 68.06,19.6 68.06,16.85 66.55,15.33 66.55,13.3 64.88,11.63 J6.3
MOTOR_6A: length 4.9
  Top Layer w0.4: U11.7 70.28,23.59 71.71,22.15 72.39,22.15 72.57,21.97 72.57,21.17 L13.1
MOTOR_6A_J: length 9.8
  Top Layer w0.4: L13.2 72.64,19.6 72.64,16.34 71.37,15.08 71.37,12.16 71.9,11.63 J7.1
MOTOR_6B: length 3.7
  Top Layer w0.4: U11.5 68.97,22.45 69.46,21.97 L14.1
MOTOR_6B_J: length 14.6
  Top Layer w0.4: L14.2 69.46,19 69.22,18.77 U23.1 69.22,16.74 69.22,16.73 69.22,16.48 70.61,15.08 70.61,11.78 72.14,10.25 74.01,10.25 J7.3
MOTOR_ADDR0: length 28.1
  Top Layer w0.254: 42.29,40.08 42.29,39.85 41.91,39.47 29.21,39.47 28.08,38.33 R26.2 28.02,36.72 27.23,36.72 27.05,36.54 27.05,34.77 27.43,34.39 U28.2 ; v1(42.33,44.29) 42.33,44.59 42.67,44.93 42.97,44.93 43.37,45.32 U6.20
  Bottom Layer w0.254: v1(42.33,44.29) 42.33,40.05
  vias: v1(42.33,40.05)
MOTOR_ADDR1: length 28.9
  Top Layer w0.254: 26.48,34.71 26.54,34.77 26.54,37.43 29.16,40.05 v1(41.53,40.05) ; 26.48,34.71 26.04,35.15 R27.2 ; 26.48,34.71 27.45,33.74 U28.3 ; v1(41.53,44.29) 41.53,44.67 42.09,45.24 U6.19
  Bottom Layer w0.254: v1(41.53,44.29) v1(41.53,40.05)
MOTOR_ADDR2: length 21.4
  Top Layer w0.254: U6.22 45.91,45.24 44.96,44.29 v1(43.94,44.29) ; 43.94,40.08 43.94,39.72 41.78,37.56 39.75,37.56 39.5,37.31 37.97,37.31 37.6,36.93 R28.2 36.8,36.29 36.7,36.19 36.7,34 35.79,33.09 U28.21
  Bottom Layer w0.254: v1(43.94,44.29) 43.94,40.05
  vias: v1(43.94,40.05)
MOTOR_ADDR3: length 20.8
  Top Layer w0.254: U28.22 35.68,33.74 36.19,34.26 36.19,37.71 36.68,38.19 R29.2 37.22,38.32 37.22,38.75 37.45,38.98 42.44,38.98 43.18,39.72 43.18,40.02 ; v1(43.14,44.29) 43.14,44.5 43.56,44.93 44.32,44.93 44.63,45.24 U6.21
  Bottom Layer w0.254: 43.14,44.29 v1(43.14,40.05)
MOTOR_ENABLE: length 12.8
  Top Layer w0.254: U6.11 34.12,51.19 33.41,51.91 26.28,51.91 25.92,51.54 R30.2 25.27,50.89 24.65,51.52 U7.1
ONEWIRE_BUS: length 10.5
  Top Layer w0.254: 13.43,35.15 13.42,35.14 R21.1 8.25,35.14 ; U30.2 3.61,35.14 J1.2
ONEWIRE_MCU: length 30.5
  Top Layer w0.254: U6.12 24.3,49.92 24,49.62 v1(24,49.04) ; v1(18.75,44.1) 21.32,44.1 24.02,46.8 ; R20.2 13.83,36.65 v1(18.75,41.57)
  Bottom Layer w0.254: v1(24,46.8) v1(24,49.04) ; v1(18.75,41.57) v1(18.75,44.1)
RAIL_OVERCURRENT: length 37.9
  Top Layer w0.254: U3.1 62.36,69.18 62.04,69.5 59.25,69.5 58.55,68.8 v1(58.55,63.09) ; U6.25 49.72,44.61 50.16,44.16 51.05,44.16 R41.1 51.11,44.1 C43.1 52.71,44.42 v1(53.97,45.69) ; v1(56.9,48.61) 58.55,50.26 v1(58.55,59.91)
  Bottom Layer w0.254: v1(53.97,45.69) v1(56.9,48.61) ; v1(58.55,59.91) v1(58.55,63.09)
REV1: length 19
  Top Layer w0.254: U9.15 18.03,31.28 17.72,31.59 16.13,31.59 15.62,32.1 15.62,33.37 16.38,34.13 22.99,34.13 24.68,32.44 U28.5
REV2: length 8.6
  Top Layer w0.254: U9.10 21.28,31.4 21.66,31.79 U28.6
REV3: length 10.1
  Top Layer w0.254: U28.14 38.6,28.54 41.66,31.59 42.29,31.59 42.53,31.36 U10.15
REV4: length 21.5
  Top Layer w0.254: U28.15 36.71,29.19 41.28,33.75 47.62,33.75 48.9,32.48 48.9,31.84 48.64,31.59 45.97,31.59 45.78,31.39 U10.10
REV5: length 36.6
  Top Layer w0.254: U11.15 67.03,31.24 66.55,31.72 51.56,31.72 48.01,35.27 40.91,35.27 36.71,31.08 34.84,31.08 U28.18
REV6: length 46.4
  Top Layer w0.254: U11.10 70.23,30.42 70.23,31.28 70.54,31.59 72.77,31.59 73.28,32.1 73.28,32.86 72.39,33.75 50.16,33.75 48.18,35.73 40.72,35.73 36.77,31.79 U28.19
STATUS_LED_A: length 2.7
  Top Layer w0.254: D3.1 18.51,60.89 18.92,61.31 19.55,61.31 R23.1
STATUS_LED_N: length 16.8
  Top Layer w0.254: U6.4 35.24,60.09 34.34,60.09 34.04,59.78 34.04,58.64 33.4,58.01 28.19,58.01 26.8,59.4 D3.2
TACHO_AC: length 2.8
  Top Layer w0.254: 66.54,54.07 C8.1 66.58,55.35 U5.3
TACHO_AMP: length 17.5
  Top Layer w0.254: 65.05,62.45 67.45,62.45 67.7,62.2 R14.1 67.87,62.16 C10.2 67.87,58.81 R10.1 67.82,58.76 67.82,57.56 68.13,57.25 ; 65.05,62.45 65.05,62.78 65.04,62.8 ; 65.05,62.45 56.9,62.45 56.3,63.06 56.3,63.19
TACHO_CMP: length 3.3
  Top Layer w0.254: 69.34,64.48 69.63,64.77 U3.5 ; 69.33,64.48 R15.1 R14.2
TACHO_FB: length 7.8
  Top Layer w0.254: R8.2 72.15,55.35 U5.4 69.84,55.35 69.47,55.72 69.47,58.63 R10.2 69.33,60.39 C10.1
TACHO_REF: length 28
  Top Layer w0.254: U3.6 71.75,66.64 76.95,61.44 R11.1 76.95,53.57 v1(76.96,53.56) ; R8.1 73.64,55.33 v1(73.64,53.55) 71.5,53.55 71.36,53.69 R9.2
  Bottom Layer w0.254: v1(73.64,53.55) 73.66,53.56 v1(76.96,53.56)
UART_RX: length 3.4
  Top Layer w0.254: U6.36 53.55,58.81 54.53,57.83 54.53,56.62
UART_RX_DBG: length 51.2
  Top Layer w0.254: v1(54.61,41.9) 54.99,42.28 54.99,53.31 54.53,53.77 R40.2 ; v1(54.61,37.5) 54.61,37.25 55.73,36.12 83.87,36.12 86.25,33.75 J9.4
  Bottom Layer w0.254: v1(54.61,41.9) v1(54.61,37.5)
UART_TX: length 5.4
  Top Layer w0.254: 56.01,56.6 56.01,57.25 53.97,59.28 53.97,59.78 53.68,60.08 U6.37
UART_TX_DBG: length 49.2
  Top Layer w0.254: J9.3 86.44,36.19 86.31,36.19 85.76,36.73 56.2,36.73 v1(55.47,37.47) ; R39.2 56.01,53.94 55.47,53.4 55.47,41.93 v1(55.5,41.9)
  Bottom Layer w0.254: 55.37,37.37 v1(55.47,37.47) 55.47,41.87 v1(55.5,41.9)
USB_CC1: length 3.5
  Top Layer w0.254: R33.1 9.17,51.02 7.79,49.64 USBC1.A5
USB_CC2: length 3.1
  Top Layer w0.254: R32.1 9.02,45.94 8.31,46.64 USBC1.B5
USB_DM: length 24.3
  Top Layer w0.254: 11.56,49.32 11.69,49.45 14.02,49.45 15.11,48.36 27.92,48.36 28.05,48.48 35.08,48.48 U6.13
USB_DN_IN: length 6.1
  Top Layer w0.254: U27.1 8.32,49.43 8.03,49.14 USBC1.B7 5.85,49.14 5.58,48.88 5.58,48.4 5.84,48.14 USBC1.A7
USB_DP: length 24.2
  Top Layer w0.254: 35.79,47.39 11.6,47.39 11.56,47.42
USB_DP_IN: length 4.9
  Top Layer w0.254: U27.3 8.44,47.53 8.33,47.64 7.98,47.64 ; 7.98,47.64 7.98,48.51 7.84,48.64 USBC1.A6 ; 7.98,47.64 USBC1.B6
USB_ILIM: length 2.6
  Top Layer w0.254: R34.1 9.53,58.01 8.89,57.37 8.89,56.23

## Copper pours and planes (outline as drawn; the poured copper is in the pictures)
3V3_MOTOR_REG on Top Layer: 68.59,45.32 69.49,45.32 69.49,44.13 68.59,44.13
GND on Top Layer: 0.5,71.5 89.5,71.5 89.5,0.5 0.5,0.5
GND on Bottom Layer: 0.5,71.5 89.5,71.5 89.5,0.5 0.5,0.5
VBUS_RAW on Top Layer: 7.59,53.86 8.29,53.86 8.29,52.35 7.59,52.35

Small or netless copper shapes (teardrops, artwork), in the pictures only: 530 on Top Layer, 77 on Bottom Layer

## Text on the board
Bottom Silkscreen Layer: LUNE-V6 / Rev 3.3 / Birkemosen.  2026-08 | Development Board - NO WARRANTY
Top Silkscreen Layer: 3V3 LOGIC | VBUS PROTECTED | Tacho Amp | Current | VBUS Protected | 3V3 Analog | 3V3 Motor | +3v3 | DATA | GND | Zone 1 | Zone 2 | Zone 3 | Zone 4 | Zone 5 | Zone 6 | SDA | SCL | TX | RX | UART | DISPLAY/I2C | Floor Heating Controller | +3v3 Motors only | One-Wire | LUNE-V6
